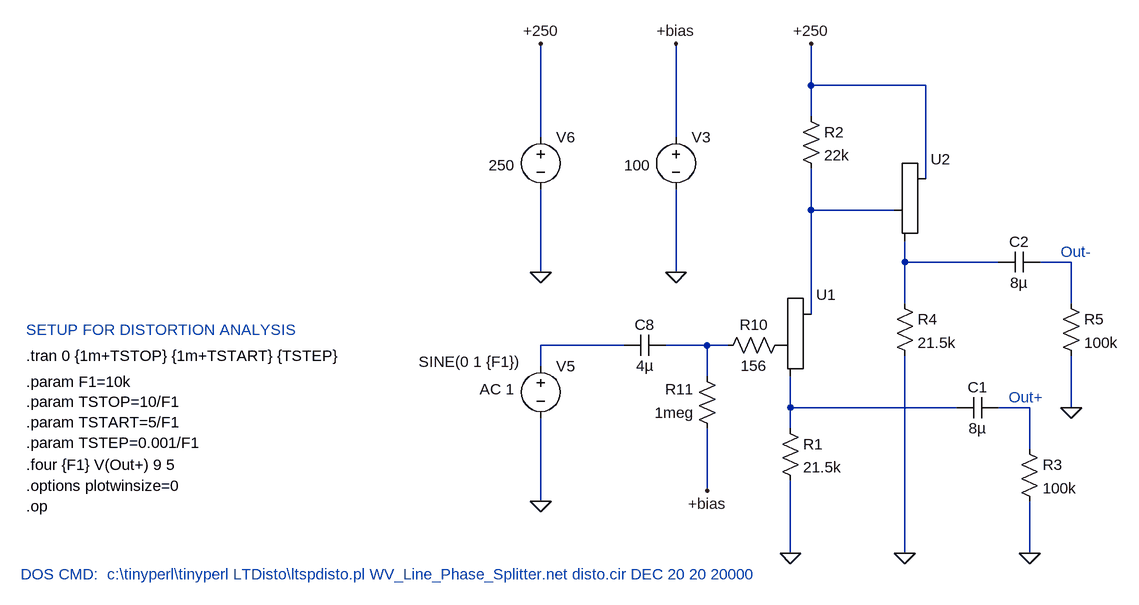
[diagram p0: schematic WV_Line_Phase_Splitter.asc]
WV_Line_Phase_Splitter.asc, the LTspice schematic file:
Version 4
SHEET 1 1876 1896
WIRE 384 896 384 832
WIRE 560 896 384 896
WIRE 384 944 384 896
WIRE -32 976 -32 832
WIRE 176 976 176 832
WIRE 560 1040 560 896
WIRE 384 1088 384 1024
WIRE 512 1088 384 1088
WIRE 528 1168 528 1136
WIRE 672 1168 528 1168
WIRE 784 1168 736 1168
WIRE -32 1184 -32 1056
WIRE 176 1184 176 1056
WIRE 528 1232 528 1168
WIRE 784 1232 784 1168
WIRE 384 1248 384 1088
WIRE 96 1296 -32 1296
WIRE 224 1296 160 1296
WIRE 256 1296 224 1296
WIRE -32 1328 -32 1296
WIRE 224 1344 224 1296
WIRE 352 1392 352 1344
WIRE 608 1392 352 1392
WIRE 720 1392 672 1392
WIRE 784 1392 784 1312
WIRE 352 1424 352 1392
WIRE 720 1456 720 1392
WIRE 224 1520 224 1424
WIRE -32 1536 -32 1408
WIRE 352 1616 352 1504
WIRE 528 1616 528 1312
WIRE 720 1616 720 1536
FLAG 352 1616 0
FLAG -32 1184 0
FLAG 384 832 +250
FLAG -32 832 +250
FLAG 720 1616 0
FLAG -32 1536 0
FLAG 176 1184 0
FLAG 176 832 +bias
FLAG 224 1520 +bias
FLAG 528 1616 0
FLAG 784 1392 0
SYMBOL cap 96 1312 R270
WINDOW 0 32 32 VTop 0
WINDOW 3 0 32 VBottom 0
WINDOW 123 -28 32 VBottom 0
SYMATTR InstName C8
SYMATTR Value 4µ
SYMBOL res 240 1440 R180
WINDOW 0 36 76 Left 0
WINDOW 3 36 40 Left 0
SYMATTR InstName R11
SYMATTR Value 1meg
SYMBOL voltage -32 960 R0
WINDOW 123 0 0 Left 0
WINDOW 39 0 0 Left 0
WINDOW 3 -80 59 Left 0
SYMATTR Value 250
SYMATTR InstName V6
SYMBOL res 240 1312 R270
WINDOW 0 32 56 VTop 0
WINDOW 3 0 56 VBottom 0
SYMATTR InstName R10
SYMATTR Value 156
SYMBOL res 336 1408 R0
SYMATTR InstName R1
SYMATTR Value 21.5k
SYMBOL res 368 928 R0
SYMATTR InstName R2
SYMATTR Value 22k
SYMBOL cap 672 1376 R90
WINDOW 0 0 32 VBottom 0
WINDOW 3 32 32 VTop 0
SYMATTR InstName C1
SYMATTR Value 8µ
SYMBOL res 704 1440 R0
SYMATTR InstName R3
SYMATTR Value 100k
SYMBOL voltage 176 960 R0
WINDOW 123 0 0 Left 0
WINDOW 39 0 0 Left 0
WINDOW 3 -80 59 Left 0
SYMATTR Value 100
SYMATTR InstName V3
SYMBOL res 512 1216 R0
SYMATTR InstName R4
SYMATTR Value 21.5k
SYMBOL cap 736 1152 R90
WINDOW 0 0 32 VBottom 0
WINDOW 3 32 32 VTop 0
SYMATTR InstName C2
SYMATTR Value 8µ
SYMBOL res 768 1216 R0
SYMATTR InstName R5
SYMATTR Value 100k
SYMBOL voltage -32 1312 R0
WINDOW 123 -94 52 Left 0
WINDOW 39 0 0 Left 0
WINDOW 3 -188 9 Left 0
SYMATTR Value2 AC 1
SYMATTR Value SINE(0 1 {F1})
SYMATTR InstName V5
SYMBOL Valve\\triode 384 1296 R0
SYMATTR InstName U1
SYMATTR SpiceModel NH12at7
SYMBOL Valve\\triode 560 1088 R0
SYMATTR InstName U2
SYMATTR SpiceModel NH12at7
TEXT -824 1544 Left 0 !.op
TEXT -824 1352 Left 0 !.param F1=10k\n.param TSTOP=10/F1\n.param TSTART=5/F1\n.param TSTEP=0.001/F1
TEXT -824 1312 Left 0 !.tran 0 {1m+TSTOP} {1m+TSTART} {TSTEP}
TEXT -824 1512 Left 0 !.options plotwinsize=0
TEXT -824 1480 Left 0 !.four {F1} V(Out+) 9 5
TEXT 768 1152 Left 0 ;Out-
TEXT 688 1376 Left 0 ;Out+
TEXT -824 1272 Left 0 ;SETUP FOR DISTORTION ANALYSIS
TEXT -832 1648 Left 0 ;DOS CMD:  c:\\tinyperl\\tinyperl LTDisto\\ltspdisto.pl WV_Line_Phase_Splitter.net disto.cir DEC 20 20 20000

The netlist it stands for:
* WV_Line_Phase_Splitter.asc
C8 N004 N005 4µ
R11 +bias N005 1meg
V6 +250 0 250
R10 N005 P001 156
R1 N006 0 21.5k
R2 +250 N001 22k
C1 N007 N006 8µ
R3 N007 0 100k
V3 +bias 0 100
R4 N002 0 21.5k
C2 N003 N002 8µ
R5 N003 0 100k
V5 N004 0 SINE(0 1 {F1}) AC 1
XU1 N001 P001 N006 NH12at7
XU2 +250 N001 N002 NH12at7
.op
.param F1=10k
.param TSTOP=10/F1
.param TSTART=5/F1
.param TSTEP=0.001/F1
.tran 0 {1m+TSTOP} {1m+TSTART} {TSTEP}
.options plotwinsize=0
.four {F1} V(Out+) 9 5
* Out-
* Out+
* SETUP FOR DISTORTION ANALYSIS
* DOS CMD:  c:\tinyperl\tinyperl LTDisto\ltspdisto.pl WV_Line_Phase_Splitter.net disto.cir DEC 20 20 20000
.backanno
.end